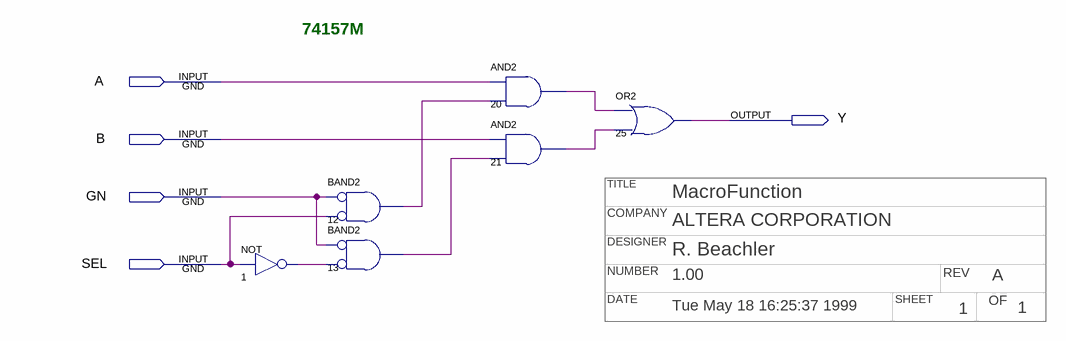
[diagram p0: schematic sheet]
// Quartus schematic 74157m.bdf as structural Verilog: 6 symbols, 5 pins
// Title block: TITLE: MacroFunction; COMPANY: ALTERA CORPORATION; DESIGNER: R. Beachler; NUMBER: 1.00; REV: A; DATE: Tue May 18 16:25:37 1999; SHEET: 1; OF: 1
module \74157m  (
  input  A,
  input  B,
  input  GN,
  input  SEL,
  output Y
);

  wire n1_out, n12_out, n13_out, n20_out, n21_out;

  not u_1 (n1_out, SEL);
  and u_12 (n12_out, ~GN, ~SEL);  // BAND2
  and u_13 (n13_out, ~GN, ~n1_out);  // BAND2
  and u_20 (n20_out, A, n12_out);
  and u_21 (n21_out, B, n13_out);
  or u_25 (Y, n20_out, n21_out);

  // Notes on the sheet:
  //   74157M
endmodule
